# EAGLE design schema (EAGLE 6.5.0)
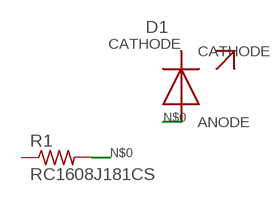
[diagram p0: schematic, sheet 1]

## Parts
D1  LED  [LED]
R1  RC1608J181CS  RESISTOR_0603  [R_0603]

## Nets
N$0: D1.ANODE R1.P$2
Unconnected: D1.CATHODE R1.P$1

## Library data of the parts
D1 = Andres_Project:LED
R1 = resistor:RESISTOR_0603

## Board
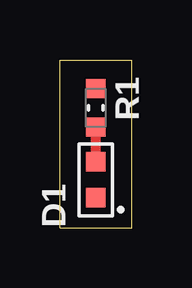
[diagram p1: board, top side]

Size 3 x 7 mm. Coordinates in mm from the lower left corner, seen from the top.
Outline: 0,0 3,0 3,7 0,7 0,0
Copper layers (1*16): Top 0.035mm / dielectric 0.2mm / Bottom 0.035mm
Design rules "MacroFab_2_Layer": minimum track width 6mil, minimum drill 12mil, track to track 6mil, track to pad 6mil, pad to pad 6mil, via to via 6mil, smd to smd 0mil, copper to edge 10mil, drill to drill 10mil, minimum pad ring 6mil, minimum via ring 6mil, stop-mask expansion 2mil, vias tented up to drill 25mil, thermal gap 10mil

### Footprints (pad centres in the part's own frame; a part is rotated, then mirrored left to right if it is on the bottom)
LED = smd 0.8 x 0.8: ANODE 0.75,0; CATHODE -0.75,0
R_0603 = smd 0.8 x 0.8: P$1 -0.8,0; P$2 0.8,0

### Placement (x,y rotation side)
D1  1.5,2 90 top
R1  1.5,5 270 top

### Tracks (layer width: path | path; a pad name or v marks a point on that pad's centre or on a via)
N$0
  Top 0.406: D1.ANODE R1.P$2